# EAGLE design opac_c1 (EAGLE 6.3)

## Sheet 1 of 2
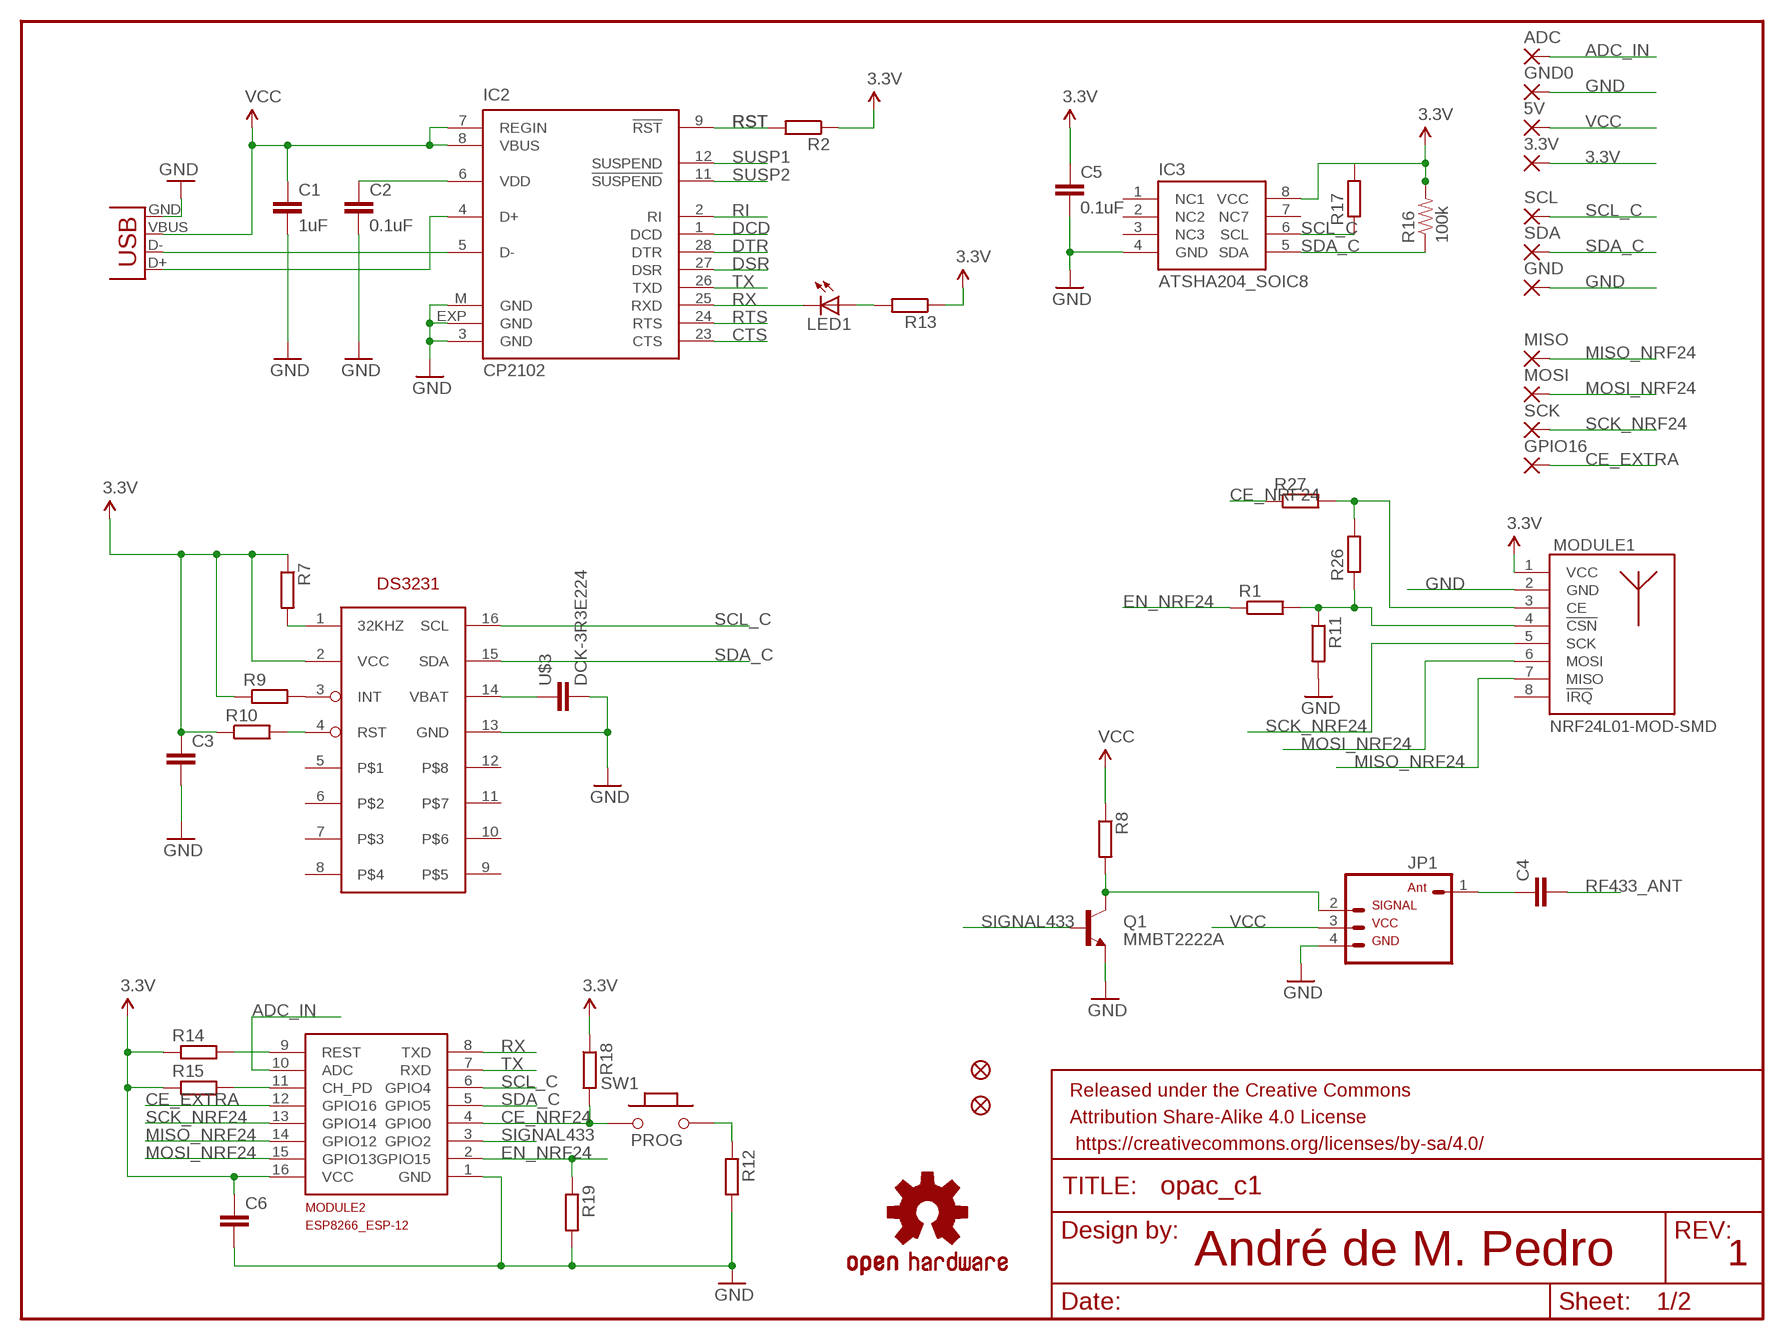
[diagram p0: schematic, sheet 1]

### Parts
3.3V  SMD2  [SMD1,27-2,54]
5V  SMD2  [SMD1,27-2,54]
ADC  SMD2  [SMD1,27-2,54]
C1  1uF  CAP0603  [0603]
C2  0.1uF  CAP0603  [0603]
C3  C-EUC0805K  [C0805K]
C4  C-EUC0603K  [C0603K]
C5  0.1uF  CAP0805  [0805]
C6  C-EUC0805K  [C0805K]
FRAME1  FRAME-LETTER  [CREATIVE_COMMONS]
GND  SMD2  [SMD1,27-2,54]
GND0  SMD2  [SMD1,27-2,54]
GPIO16  SMD2  [SMD1,27-2,54]
IC1  DS3231WIDE  [SO16W]
IC2  CP2102  CP210X_USB_UART  [MLP28]
IC3  ATSHA204_SOIC8  [SOIC8]
JP1  RF433SMD  [1X04-SMD]
JP2  FIDUCIAL1X2.5  [FIDUCIAL-1X2.5]
JP3  FIDUCIAL1X2.5  [FIDUCIAL-1X2.5]
LED1  LEDCHIP-LED0805  [CHIP-LED0805]
LOGO1  OSHW-LOGOL  [OSHW-LOGO-L]
MISO  SMD2  [SMD1,27-2,54]
MODULE1  NRF24L01-MOD-SMD  [SMD8-MODULE]
MODULE2  ESP8266_ESP-12  [ESP8266-ESP12]
MOSI  SMD2  [SMD1,27-2,54]
Q1  MMBT2222A  TRANSISTOR_NPNMMBT2222A  [SOT23-3]
R1  R-EU_R0805  [0805]
R2  R-EU_R0603  [R0603]
R7  R-EU_R0805  [0805]
R8  R-EU_R0805  [0805]
R9  R-EU_R0805  [0805]
R10  R-EU_R0805  [0805]
R11  R-EU_R0805  [0805]
R12  R-EU_R0805  [0805]
R13  R-EU_R0603  [R0603]
R14  R-EU_R0805  [0805]
R15  R-EU_R0805  [0805]
R16  100k  RESISTOR0805-RES  [0805]
R17  R-EU_R0805  [0805]
R18  R-EU_R0805  [0805]
R19  R-EU_R0805  [0805]
R26  R-EU_R0805  [0805]
R27  R-EU_R0805  [0805]
SCK  SMD2  [SMD1,27-2,54]
SCL  SMD2  [SMD1,27-2,54]
SDA  SMD2  [SMD1,27-2,54]
SW1  PROG  PB157  [157SW]
U$3  DCK-3R3E224  [DCK-3R3E224]
USB1  USB-MICROB  [USB-MICROB]

### Nets
3.3V: 3.3V.1(P) C3.1 C5.1 C6.1 IC1.2(VCC) IC3.8(VCC) MODULE1.1(VCC) MODULE2.16(VCC) R2.1 R7.1 R9.1 R10.1 R13.1 R14.1 R15.1 R16.2 R17.2 R18.1 ; also sheet 2
ADC_IN: ADC.1(P) MODULE2.10(ADC)
CE_EXTRA: GPIO16.1(P) MODULE2.12(GPIO16)
CE_NRF24: MODULE2.4(GPIO0) R18.2 R27.1 SW1.1
CTS: IC2.23(CTS)
DCD: IC2.1(DCD)
DSR: IC2.27(DSR)
DTR: IC2.28(DTR)
EN_NRF24: MODULE2.2(GPIO15) R1.1 R19.1
GND: C1.2 C2.2 C3.2 C5.2 C6.2 GND0.1(P) GND.1(P) IC1.13(GND) IC2.3(GND) IC2.EXP(GND) IC2.M(GND) IC3.4(GND) JP1.4 MODULE1.2(GND) MODULE2.1(GND) Q1.2(E) R11.2 R12.2 R19.2 U$3.P$1 USB1.GND ; also sheet 2
MISO_NRF24: MISO.1(P) MODULE1.7(MISO) MODULE2.14(GPIO12)
MOSI_NRF24: MODULE1.6(MOSI) MODULE2.15(GPIO13) MOSI.1(P)
N$1: IC1.14(VBAT) U$3.P$2
N$2: IC1.3(INT) R9.2
N$3: MODULE1.4(!CSN) R1.2 R11.1 R26.1
N$4: C2.1 IC2.6(VDD)
N$10: IC1.1(32KHZ) R7.2
N$11: R12.1 SW1.2
N$13: IC2.5(D-) USB1.D-
N$16: IC2.4(D+) USB1.D+
N$19: JP1.2 Q1.3(C) R8.2
N$23: MODULE1.3(CE) R26.2 R27.2
N$24: IC1.4(RST) R10.2
N$25: LED1.A R13.2
N$26: C4.1 JP1.1
N$27: MODULE2.9(REST) R14.2
N$28: MODULE2.11(CH_PD) R15.2
RF433_ANT: C4.2
RI: IC2.2(RI)
RST: IC2.9(!RST) R2.2
RTS: IC2.24(RTS)
RX: IC2.25(RXD) LED1.C MODULE2.8(TXD)
SCK_NRF24: MODULE1.5(SCK) MODULE2.13(GPIO14) SCK.1(P)
SCL_C: IC1.16(SCL) IC3.6(SCL) MODULE2.6(GPIO4) R17.1 SCL.1(P)
SDA_C: IC1.15(SDA) IC3.5(SDA) MODULE2.5(GPIO5) R16.1 SDA.1(P)
SIGNAL433: MODULE2.3(GPIO2) Q1.1(B)
SUSP1: IC2.12(SUSPEND)
SUSP2: IC2.11(!SUSPEND)
TX: IC2.26(TXD) MODULE2.7(RXD)
VCC: 5V.1(P) C1.1 IC2.7(REGIN) IC2.8(VBUS) JP1.3 R8.1 USB1.VBUS ; also sheet 2
Unconnected: IC1.5 IC1.6 IC1.7 IC1.8 IC1.9 IC1.10 IC1.11 IC1.12 IC3.1(NC1) IC3.2(NC2) IC3.3(NC3) IC3.7(NC7) MODULE1.8(!IRQ)

### Notes on the sheet
- André de M. Pedro | 1

## Sheet 2 of 2
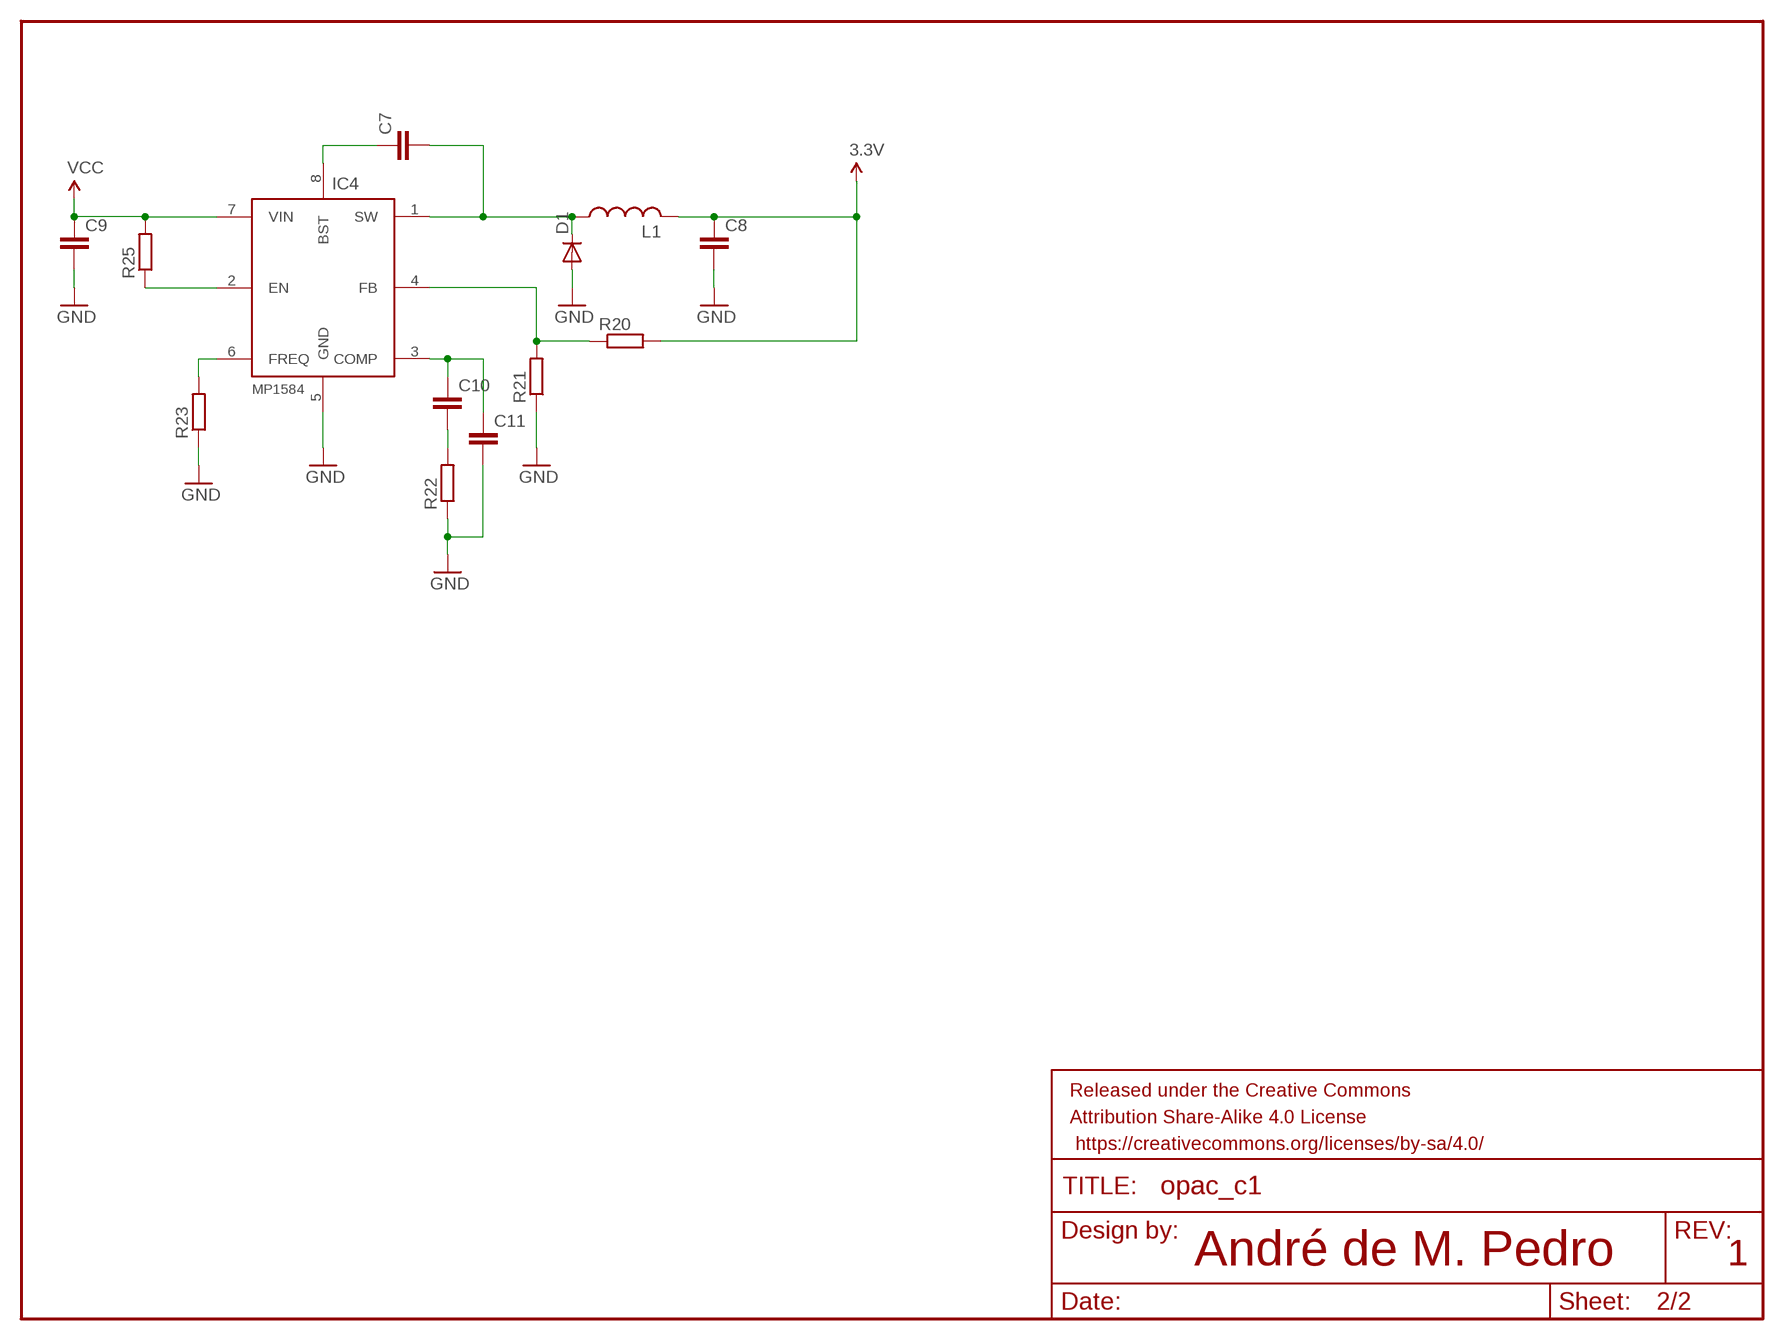
[diagram p1: schematic, sheet 2]

### Parts
C7  C-EUC0603  [C0603]
C8  C-EUC3216  [C3216]
C9  C-EUC3216  [C3216]
C10  C-EUC0603  [C0603]
C11  C-EUC0603  [C0603]
D1  DIODESMA  [SMA-DIODE]
FRAME2  FRAME-LETTER  [CREATIVE_COMMONS]
IC4  MP1584  [SO08-EPAD]
L1  IHLP-2525CZ-01  [2525]
R20  R-EU_R0603  [R0603]
R21  R-EU_R0603  [R0603]
R22  R-EU_R0603  [R0603]
R23  R-EU_R0603  [R0603]
R25  R-EU_R0603  [R0603]

### Nets
3.3V: C8.1 L1.P$1 R20.2 ; also sheet 1
GND: C8.2 C9.2 C11.2 D1.A IC4.5(GND) R21.1 R22.1 R23.1 ; also sheet 1
N$17: C7.2 D1.C IC4.1(SW) L1.P$2
N$18: C7.1 IC4.8(BST)
N$31: IC4.4(FB) R20.1 R21.2
N$32: IC4.2(EN) R25.1
N$33: IC4.6(FREQ) R23.2
N$34: C10.1 C11.1 IC4.3(COMP)
N$35: C10.2 R22.2
VCC: C9.1 IC4.7(VIN) R25.2 ; also sheet 1

### Notes on the sheet
- André de M. Pedro | 1

## Library data of the parts
3.3V 5V ADC GND GND0 GPIO16 MISO MOSI SCK SCL SDA = wirepad:SMD2: SMD PAD
C1 C2 = SparkFun:CAP: Capacitor Standard 0603 ceramic capacitor, and 0.1" leaded capacitor.
C3 C4 C6-C11 = resistor:C-EU: CAPACITOR, European symbol
C5 = SparkFun-Passives:CAP: Capacitor Standard 0603 ceramic capacitor, and 0.1" leaded capacitor.
D1 = SparkFun:DIODE: Diode These are standard reverse protection diodes and small signal diodes. SMA package can handle up to about 1A. SOD-323 can handle about 200mA. What the SOD-323 package when ordering, there are some mfgs out there that are 5-pin packages.
FRAME1 FRAME2 = SparkFun-Aesthetics:FRAME-LETTER: Schematic Frame Standard 8.5x11 US Letter frame
IC1 = DS3231:DS3231
IC2 = SparkFun:CP210X_USB_UART: Single-Chip USB to UART Bridge Source: www.silabs.com .. CP2101.pdf / cp2102.pdf. Spark Fun Electronics SKU : COM-00310
IC3 = SparkFun-DigitalIC:ATSHA204_SOIC8: ATSHA204; PROD_ID: IC-11981
IC4 = apedro_lib:MP1584
JP1 = apedro_lib:RF433: Header 4 Standard 4-pin 0.1" header. Use with straight break away headers (SKU : PRT-00116), right angle break away headers (PRT-00553), swiss pins (PRT-00743), machine pins (PRT-00117), and female headers (PRT-00115). Molex polarized connector foot print use with SKU : PRT-08231 with associated crimp pins and housings.
JP2 JP3 = SparkFun:FIDUCIAL: Fiducial Alignment Points Various fiducial points for machine vision alignment.
L1 = RNH_IHLP-2525CZ-01:IHLP-2525CZ-01
LED1 = led:LED: LED OSRAM: - CHIPLED LG R971, LG N971, LY N971, LG Q971, LY Q971, LO R971, LY R971 LH N974, LH R974 LS Q976, LO Q976, LY Q976 LO Q996 - Hyper CHIPLED LW Q18S LB Q993, LB Q99A, LB R99A - SideLED LS A670, LO A670, LY A670, LG A670, LP A670 LB A673, LV A673, LT A673, LW A673 LH A674 LY A675 LS A676, LA A676, LO A676, LY A676, LW A676 LS A679, LY A679, LG A679 - Hyper Micro SIDELED® LS Y876, LA Y876, LO Y876, LY Y876 LT Y87S - SmartLED LW L88C, LW L88S LB L89C, LB L89S, LG L890 LS L89K, LO L89K, LY L89K LS L896, LA L896, LO L896, LY L896 - TOPLED LS T670, LO T670, LY T670, LG T670, LP T670 LSG T670, LSP T670, LSY T670, LOP T670, LYG T670 LG T671, LOG T671, LSG T671 LB T673, LV T673, LT T673, LW T673 LH T674 LS T676, LA T676, LO T676, LY T676, LB T676, LH T676, LSB T676, LW T676 LB T67C, LV T67C, LT T67C, LS T67K, LO T67K, LY T67K, LW E67C LS E67B, LA E67B, LO E67B, LY E67B, LB E67C, LV E67C, LT E67C LW T67C LS T679, LY T679, LG T679 LS T770, LO T770, LY T770, LG T770, LP T770 LB T773, LV T773, LT T773, LW T773 LH T774 LS E675, LA E675, LY E675, LS T675 LS T776, LA T776, LO T776, LY T776, LB T776 LHGB T686 LT T68C, LB T68C - Hyper Mini TOPLED® LB M676 - Mini TOPLED Santana® LG M470 LS M47K, LO M47K, LY M47K Source: http://www.osram.convergy.de LUXEON: - LUMILED® LXK2-PW12-R00, LXK2-PW12-S00, LXK2-PW14-U00, LXK2-PW14-V00 LXK2-PM12-R00, LXK2-PM12-S00, LXK2-PM14-U00 LXK2-PE12-Q00, LXK2-PE12-R00, LXK2-PE12-S00, LXK2-PE14-T00, LXK2-PE14-U00 LXK2-PB12-K00, LXK2-PB12-L00, LXK2-PB12-M00, LXK2-PB14-N00, LXK2-PB14-P00, LXK2-PB14-Q00 LXK2-PR12-L00, LXK2-PR12-M00, LXK2-PR14-Q00, LXK2-PR14-R00 LXK2-PD12-Q00, LXK2-PD12-R00, LXK2-PD12-S00 LXK2-PH12-R00, LXK2-PH12-S00 LXK2-PL12-P00, LXK2-PL12-Q00, LXK2-PL12-R00 Source: www.luxeon.com KINGBRIGHT: KA-3528ASYC Source: www.kingbright.com
LOGO1 = SparkFun-Aesthetics:OSHW-LOGO: Open Source Hardware Logo This logo indicates the piece of hardware it is found on incorporates a OSHW license and/or adheres to the definition of open source hardware found here: http://freedomdefined.org/OSHW
MODULE1 = nrf24l01:NRF24L01-MOD: NRF24L01 based module VCC = 1.9~3.6V
MODULE2 = ESP8266-ESP12:ESP8266_ESP-12
Q1 = SparkFun-DiscreteSemi:TRANSISTOR_NPN: Generic NPN BJT MMBT2222A - TRANS-08049 (SOT-23, 1A 40V) MPSA42 - TRANS-09116 (SOT-23, 500mA 300V) MMBT5088LT1G - TRANS-11160 (SOT-23, 50 mA 30V) BC547 - COM-08928 <http://www.sparkfun.com/products/8928> (TO-92 45V 100mA) (1.Collector 2.Base 3.Emitter) 2N3904 - COM-00521 <http://www.sparkfun.com/products/521> (TO-92 40V 200mA) (1.Emitter 2.Base 3.Collector) P2N2222A - COM-12852 <http://www.sparkfun.com/products/12852> (TO-92 40V 600mA) (1.Collector 2.Base 3.Emitter); PROD_ID: TRANS-08049
R1 R2 R7-R15 R17-R23 R25-R27 = resistor:R-EU_: RESISTOR, European symbol
R16 = SparkFun-Passives:RESISTOR: Resistor Basic schematic elements and footprints for 0603, 1206, and PTH resistors.
SW1 = MySMD:PB157; PARTNO: RS 682-1421
U$3 = apedro_lib:DCK-3R3E224
USB1 = SparkFun:USB: USB Connectors USB-B-PTH is fully proven SKU : PRT-00139 USB-miniB is fully proven SKU : PRT-00587 USB-A-PCB is untested. USB-A-H is throughly reviewed, but untested. Spark Fun Electronics SKU : PRT-00437 USB-B-SMT is throughly reviewed, but untested. Needs silkscreen touching up. USB-A-S has not been used/tested USB-MB-H has not been used/tested

## Board
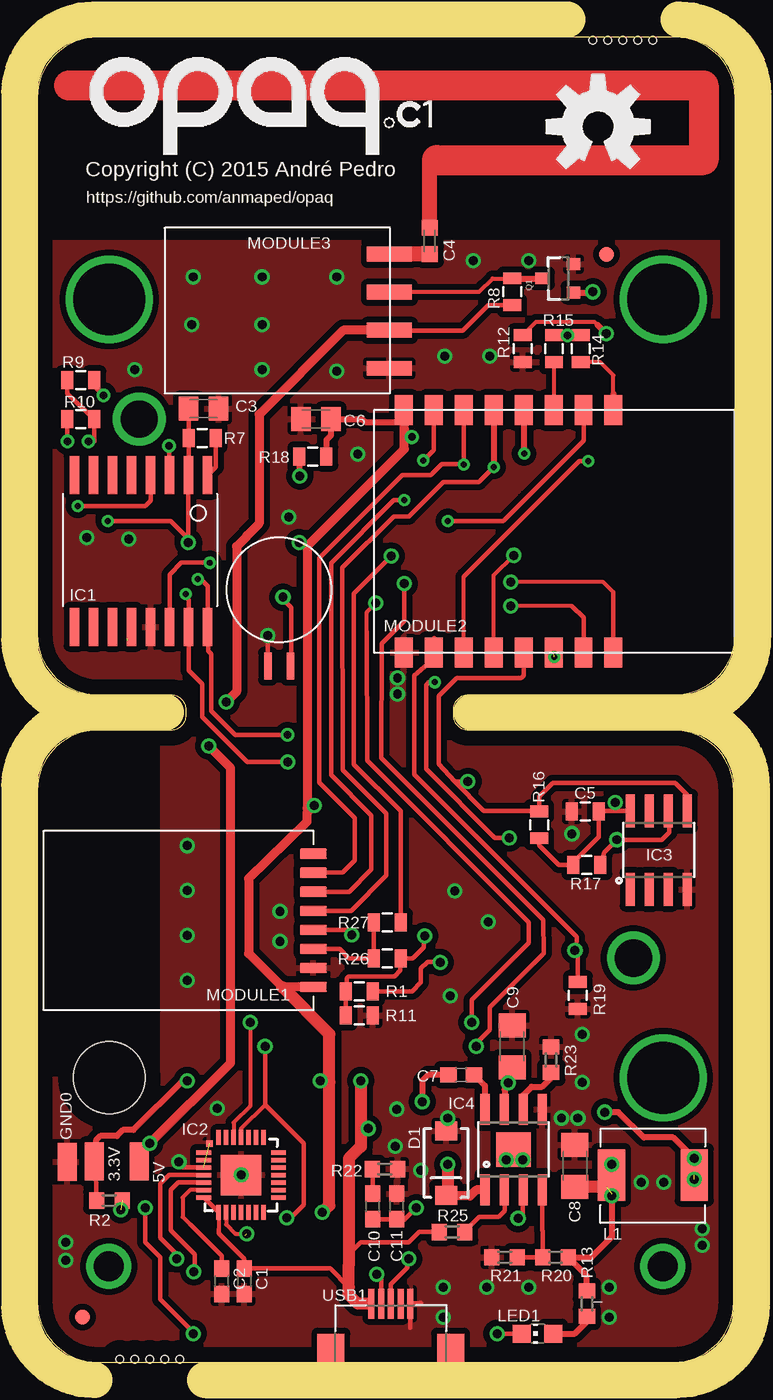
[diagram p2: board, top side]
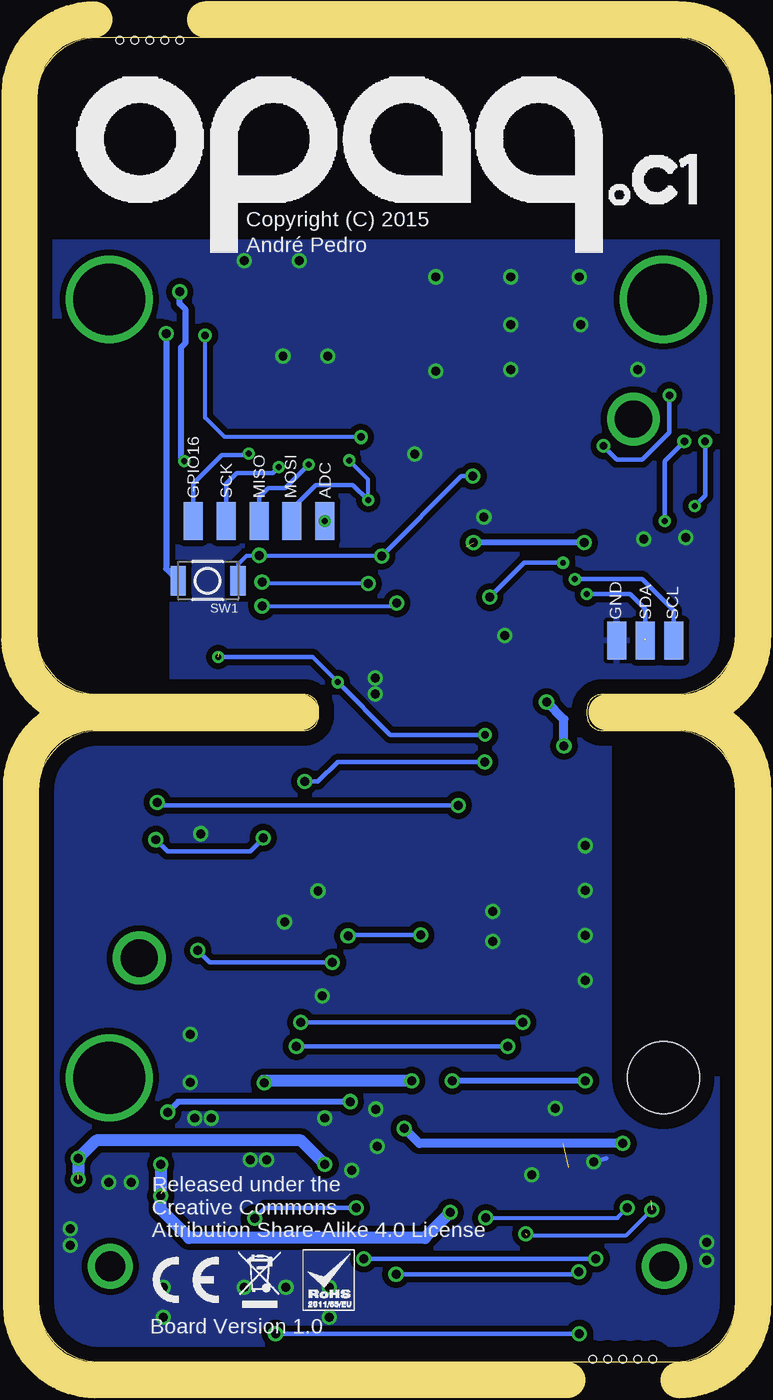
[diagram p3: board, bottom side, seen from below]

Size 46.6 x 88.5 mm. Coordinates in mm from the lower left corner, seen from the top.
Outline: 46.5,4 46.5,38.2 arc90 42.5,42.2 28.8,42.2 arc-90 27.8,43.2 27.8,43.6 arc-90 28.8,44.6 42.6,44.6 arc90 46.6,48.6 46.6,84.5 arc90 42.6,88.5 4,88.5 arc90 0,84.5 0,48.6 arc90 4,44.6 8.9,44.6 arc-90 9.9,43.6 9.9,43.2 arc-90 8.9,42.2 4,42.2 arc90 0,38.2 0,4 arc90 4,0 42.5,0 arc90 46.5,4
Copper layers (1*16): Top 0.035mm / dielectric 1.5mm / Bottom 0.035mm
Design rules "default *": minimum track width 10mil, minimum drill 5mil, track to track 7mil, track to pad 7mil, pad to pad 7mil, via to via 7mil, smd to smd 7mil, copper to edge 40mil, drill to drill 8mil, minimum pad ring 10mil, minimum via ring 8mil, stop-mask expansion 4mil, vias tented up to drill 0mil, thermal gap 10mil
Holes 4.8 mm at 4.8,19
Holes 0.5 mm at 5.5,0.2 6.5,0.2 7.5,0.2 8.5,0.2 9.5,0.2 37.1,88.3 38.1,88.3 39.1,88.3 40.1,88.3 41.1,88.3
tRestrict: area 0.1,75.4 to 46.5,88.5; area 0,19.5 to 7.8,41.5; area 38.2,43.5 to 46.5,69.3
bRestrict: area 38.2,43.5 to 46.5,69.3; area 0.1,75.4 to 46.5,88.5; area 0,19.5 to 7.8,41.5
Milling: 16 lines

### Footprints (pad centres in the part's own frame; a part is rotated, then mirrored left to right if it is on the bottom)
SMD1,27-2,54 = smd 1.27 x 2.54: 1 0,0
0603 = smd 1.1 x 1: 1 -0.85,0; 2 0.85,0
C0805K = smd 1.3 x 1.6: 1 -1,0; 2 1,0
C0603K = smd 1.05 x 1.08: 1 -0.875,0; 2 0.875,0
0805 = smd 0.8 x 1.2: 1 -0.9,0; 2 0.9,0
C0603 = smd 1.1 x 1: 1 -0.85,0; 2 0.85,0
C3216 = smd 1.6 x 1.8: 1 -1.4,0; 2 1.4,0
SMA-DIODE = smd 1.27 x 1.47: A -2.15,0; C 2.15,0
SO16W = smd 0.635 x 2.54: 1 0.635,-1.27; 2 1.905,-1.27; 3 3.175,-1.27; 4 4.445,-1.27; 5 5.715,-1.27; 6 6.985,-1.27; 7 8.255,-1.27; 8 9.525,-1.27; 9 9.525,8.89; 10 8.255,8.89; 11 6.985,8.89; 12 5.715,8.89; 13 4.445,8.89; 14 3.175,8.89; 15 1.905,8.89; 16 0.635,8.89
MLP28 = smd 1 x 0.3: 1 -2.5,1.5; 2 -2.5,1; 3 -2.5,0.5; 4 -2.5,0; 5 -2.5,-0.5; 6 -2.5,-1; 7 -2.5,-1.5; 15 2.5,-1.5; 16 2.5,-1; 17 2.5,-0.5; 18 2.5,0; 19 2.5,0.5; 20 2.5,1; 21 2.5,1.5 | smd 0.3 x 1: 8 -1.5,-2.5; 9 -1,-2.5; 10 -0.5,-2.5; 11 0,-2.5; 12 0.5,-2.5; 13 1,-2.5; 14 1.5,-2.5; 22 1.5,2.5; 23 1,2.5; 24 0.5,2.5; 25 0,2.5; 26 -0.5,2.5; 27 -1,2.5; 28 -1.5,2.5 | smd 2.7 x 2.7: EXP 0,0 | smd 0.435 x 0.435: M -2.103,2.103
SOIC8 = smd 0.61 x 2.21: 1 -1.905,-2.616; 2 -0.635,-2.616; 3 0.635,-2.616; 4 1.905,-2.616; 5 1.905,2.616; 6 0.635,2.616; 7 -0.635,2.616; 8 -1.905,2.616
SO08-EPAD = smd 0.61 x 2.057: 1 -1.905,-2.692; 2 -0.635,-2.692; 3 0.635,-2.692; 4 1.905,-2.692; 5 1.905,2.692; 6 0.635,2.692; 7 -0.635,2.692; 8 -1.905,2.692 | smd 2.286 x 2.286: EPAD 0,0
1X04-SMD = smd 1 x 3: 1 -3.81,5; 2 -1.27,5; 3 1.27,5; 4 3.81,5
FIDUCIAL-1X2.5 = smd 1 x 1: 1 0,0
2525 = smd 1.829 x 3.429: P$1 2.769,0; P$2 -2.769,0
CHIP-LED0805 = smd 1.2 x 1.2: A 0,-1.05; C 0,1.05
SMD8-MODULE = smd 0.7 x 1.8: 1 -4.445,0; 2 -3.175,0; 3 -1.905,0; 4 -0.635,0; 5 0.635,0; 6 1.905,0; 7 3.175,0; 8 4.445,0
ESP8266-ESP12 = smd 2 x 1.2: 1 16.2,2; 2 16.2,4; 3 16.2,6; 4 16.2,8; 5 16.2,10; 6 16.2,12; 7 16.2,14; 8 16.2,16; 9 0,16; 10 0,14; 11 0,12; 12 0,10; 13 0,8; 14 0,6; 15 0,4; 16 0,2
SOT23-3 = smd 0.8 x 0.9: 1 -0.95,-1; 2 0.95,-1; 3 0,1.1
R0603 = smd 1 x 1.1: 1 -0.85,0; 2 0.85,0
157SW = smd 1.016 x 1.981: 1 0,0; 2 4,0
DCK-3R3E224 = smd 0.5 x 1.8: P$1 -0.75,-5.1; P$2 0.75,-5.11
USB-MICROB = smd 0.4 x 2: D+ 0,3.1; D- -0.65,3.1; GND 1.3,3.1; ID 0.65,3.1; VBUS -1.3,3.1 | smd 1.8 x 1.9: GND@2 -4,0.15; GND@3 4,0.15

### Placement (x,y rotation side)
3.3V  3.8,13.4 0 top
5V  6.8,13.4 0 top
ADC  27.4,56.2 0 bottom
C1  13.8,5.4 270 top
C2  12.3,5.4 270 top
C3  11.1,63.7 0 top
C4  26.2,74.9 90 top
C5  36.6,36.8 180 top
C6  18.6,63 180 top
C7  28.3,19.2 180 top
C8  35.9,13.1 90 top
C9  31.7,21.1 90 top
C10  22.4,10.4 90 top
C11  24,10.4 90 top
D1  27.3,13.3 270 top
FRAME1  -12.7,-17.7 0 top  (outside the outline)
FRAME2  -12.7,-17.7 0 top  (outside the outline)
GND  7.9,48.2 0 bottom
GND0  1.98,13.37 0 top
GPIO16  36.2,56.2 0 bottom
IC1  12,58 180 top
IC2  13.6,12.5 0 top
IC3  41.5,34.2 0 top
IC4  31.8,14.2 0 top
JP1  18.5,70.2 270 top
JP2  3,3 0 top
JP3  38,74 0 top
L1  41.1,12.5 180 top
LED1  33.4,1.9 90 top
LOGO1  37.44,82.53 0 top
MISO  31.8,56.2 0 bottom
MODULE1  18.43,29.51 90 top
MODULE2  22.47,63.6 270 top
MOSI  29.6,56.2 0 bottom
Q1  34.8,72.4 90 top
R1  21.51,24.77 180 top
R2  4.8,10.8 0 top
R7  11,61.72 0 top
R8  31.7,71.5 90 top
R9  2.9,65.6 0 top
R10  2.9,63 180 top
R11  21.48,23.15 0 top
R12  32.4,67.7 270 top
R13  36.7,3.9 270 top
R14  36.3,67.7 270 top
R15  34.5,67.7 270 top
R16  33.5,35.9 270 top
R17  36.7,33.2 180 top
R18  18.4,60.5 180 top
R19  36.1,24.5 270 top
R20  34.6,7 0 top
R21  31.2,7 0 top
R22  23.2,12.9 180 top
R23  34.3,20.2 270 top
R25  27.7,8.7 180 top
R26  23.37,26.98 180 top
R27  23.37,29.36 180 top
SCK  34,56.2 0 bottom
SCL  4.1,48.2 0 bottom
SDA  6,48.2 0 bottom
SW1  33.2,52.2 180 bottom
U$3  16.14,51.6 0 top
USB1  23.6,0.8 0 top

### Tracks (layer width: path | path; a pad name or v marks a point on that pad's centre or on a via)
3.3V  (via drill 0.4, 0.5, 0.6)  (2 unrouted)
  Top 0.254: MODULE2.16 24.5,63.57 24.5,62.3 v25,61.8
  Top 0.305: R16.2 33.5,34.5 34.8,33.2 R17.2 36.15,33.75 37.5,35.1 C5.1 37.52,36.82 38.7,36.82 | IC3.8 38.7,36.82 | 18,36.7 18.15,36.85 v18.5,37.2 | v38.6,37.4 38.6,36.92 38.7,36.82 | R2.1 3.85,13.35 3.3V.1 | v3.4,61.5 3.8,61.5 R10.1 2,64.7 R9.1 | v4.7,56.2 8.9,56.2 10.09,55.02 v10.09,54.74 10.09,59.26 IC1.2 | IC1.2 | IC1.2 R7.1 C3.1
  Top 0.406: R14.1 v35.4,68.6 R15.1 | 24.5,62.65 MODULE2.16 24.35,62.8 21.9,62.8 21.7,63 C6.1 19.6,61.9 19.3,61.6 R18.1 | 3.9,12.7 3.3V.1 3.9,13.5 3.9,14.8 4.2,15.1 5.3,15.1 5.7,15.5 6.4,15.5 9.7,18.8 v10,18.8 | v18.9,18.8 19.4,18.8 19.5,18.7 | v38.36,11.1 38.36,8.36 37,7 R20.2 36.7,5.75 R13.1
  Top 0.61: 18,36.7 18,36.1 14.1,32.3 14.1,27.3 16.34,25.07 MODULE1.1 | 24.5,62.65 24.5,62.3 24.5,61 17.97,54.47 18.01,54.43 18.01,36.99 18.15,36.85
  Top 0.813: 16.34,25.07 19.5,21.9 19.5,18.7 19.5,10.46 v19.03,9.99 | 35.9,11.4 C8.1 38.03,11.7 L1.P$1
  Bottom 0.254: v25,61.8 34.1,61.8 35.4,63.1 v35.4,68.6
  Bottom 0.305: v18.5,37.2 38.4,37.2 v38.6,37.4 | v3.4,61.5 4.7,60.2 v4.7,56.2
  Bottom 0.406: v10,18.8 v18.9,18.8 | v10.09,54.74 v17.48,54.74 | v38.36,11.1 38.36,11.24
  Bottom 0.813: v19.03,9.99 20.72,8.3 36.46,8.3 38.36,10.2 v38.36,11.1 v38.36,13.2
ADC_IN  (via drill 0.4)
  Top 0.305: MODULE2.10 36.47,61.57 32.7,57.8 32.5,57.6 31.1,56.2 ADC.1
  other vias: 27.4,56.2
CE_EXTRA  (via drill 0.4)
  Top 0.406: v32.5,60.7 32.5,62.65 MODULE2.12
  Bottom 0.305: GPIO16.1 36.2,58.7 34.3,60.6 32.6,60.6 v32.5,60.7
CE_NRF24  (via drill 0.6)
  Top 0.254: MODULE2.4 30.47,52.57 v31.8,53.9
  Top 0.305: v23.62,53.86 22.63,52.86 21.13,51.36 21.13,39.93 24.26,36.81 24.26,29.38 R27.1 24.29,29.39
  Top 0.406: R18.2 17.5,59.88 v17.51,59.19
  Bottom 0.254: 31.76,53.86 32.64,53.86 33.2,53.3 SW1.1 | v23.62,53.86 31.76,53.86 | 31.76,53.86 v31.8,53.9
  Bottom 0.305: v17.51,59.19 18.29,59.19 v23.62,53.86
EN_NRF24  (via drill 0.6)
  Top 0.305: 36,27.6 36.02,28.42 25.17,39.27 25.17,45.87 26.5,47 26.5,48.37 MODULE2.2 | R19.1 36.1,27.3 | R1.1 25.02,24.77 25.6,25.35 25.6,26.29 26.06,26.75 26.85,26.75 v26.9,26.7
  Top 0.406: 36,27.6 v35.9,27.5 36.1,27.3
  Bottom 0.305: v26.9,26.7 35.1,26.7 v35.9,27.5
GND  (via drill 0.6)  (1 unrouted)
  Top 0.305: 24.9,3.8 24.9,2.3 | IC2.3 9.5,13 v9.45,13.37 | U$3.P$1 v15.39,48.54
  Top 0.406: USB1.GND 25.6,3.9
  Bottom 0.305: v9.45,13.37 8.6,13.6
  other vias: 27.2,67.2 30.2,67.2 3.3,55.1 6.1,55 24.05,45.7 6.5,66.3 16.2,28.1 16.2,30.1 35.7,35.3 20,66.2 36.4,21.9 10.4,72.5 29.1,73.6 20,72.5 15,72.5 10.3,69.3 15,69.3 15,66.3 32.8,73.6 24.05,44.63 27.1,3 27.1,5 30,5 32.8,5 38.2,3 38.2,5 24,16.9 27.4,16.3 23.9,14.4 13.6,12.5 40.34,12 35,16.3 36.4,18.7 36.1,16.3 41.83,12 25.6,12.8 31.3,13.5 32.4,13.5 10,34.5 10,31.5 10,28.5 10,25.5 16.78,56.44 21.4,60.66 12.01,16.95 1.9,6.8 1.9,8 27.86,31.47 30.1,29.41 27.58,24.46 44.4,7.8 44.4,8.9
  pour Top (isolate 0.406): 0,88.5 46.5,88.5 46.5,0 0,0
  pour Bottom (isolate 0.406): 0,88.5 46.5,88.5 46.5,0 0,0
MISO_NRF24  (via drill 0.4)
  Top 0.305: 18.45,32.7 20.4,32.7 21.2,33.5 21.2,36.36 18.82,38.74 18.82,53.72 24.37,59.27 26.27,59.27 27,60 28.44,60 v28.47,59.97 MODULE2.14
  Top 0.406: 18.45,32.7 MODULE1.7
  Bottom 0.305: MISO.1 31.8,57.8 31.2,58.4 30.04,58.4 v28.47,59.97
MOSI_NRF24  (via drill 0.4)
  Top 0.305: 24.05,57.58 v24.51,57.58 23.8,57.58 19.61,53.39 19.61,39.22 22.3,36.53 22.3,32.9 20.82,31.41 MODULE1.6 | MODULE2.15 26.47,60.93 v25.78,60.24
  Bottom 0.254: v24.51,57.58 24.51,58.97 v25.78,60.24
  Bottom 0.305: MOSI.1 29.6,57 28,58.6 25.53,58.6 v24.51,57.58
N$1  (via drill 0.4, 0.6)
  Top 0.305: v16.4,51.1 16.4,50.96 16.94,50.42 16.94,46.54 U$3.P$2 | IC1.14 8.82,52.62 9.6,53.4 v11.5,53.4
  Bottom 0.305: v16.4,51.1 14.1,53.4 v11.5,53.4
N$2  (via drill 0.5)
  Top 0.305: v8.8,61.2 8.8,59.3 IC1.3 | R9.2 3.8,65.2 v4.4,64.6
  Bottom 0.305: v8.8,61.2 7.9,60.3 6.2,60.3 4.4,62.1 v4.4,64.6
N$3  (via drill 0.6)
  Top 0.305: R11.1 20.58,24.9 R1.2 20.65,24.81 20.65,25.63 20.8,25.78 23.85,25.78 24.23,26.16 24.23,26.94 R26.1 25.08,26.98 25.8,27.7 25.8,28.42 v25.86,28.48 | MODULE1.4 20.66,28.88 v21.01,28.53
  Bottom 0.305: v21.01,28.53 25.86,28.53 v25.86,28.48
N$4
  Top 0.254: IC2.6 10.2,11.5 9.7,11 9.7,9.7 10.2,9.2
  Top 0.305: 12.2,6.35 C2.1 12.3,7.1 10.2,9.2
N$7  (via drill 2.5 pad 3)
  other vias: 6.8,63
N$8  (via drill 2 pad 3)
  other vias: 4.75,6.4
N$9  (via drill 2 pad 3)
  other vias: 41.75,6.4
N$10
  Top 0.305: R7.2 11.9,59.8 IC1.1
N$11  (via drill 0.6)
  Top 0.254: R12.1 33.3,69.5 37.2,69.5 37.4,69.3
  Top 0.406: 37.4,69.3 v38,68.7
  Bottom 0.406: v38,68.7 38,53 SW1.2 | SW1.2 | SW1.2
N$12  (via drill 4.8 pad 5.8)
  other vias: 41.8,19
N$13  (via drill 0.6)
  Top 0.305: USB1.D- 22.95,5.75 v22.65,5.87 | IC2.5 9.4,12 8.9,11.5 8.9,8.8 10.49,7.21 10.49,6.06 v10.45,6.02
  Bottom 0.305: v22.65,5.87 10.61,5.87 v10.45,6.02
N$14  (via drill 4.8 pad 5.8)
  other vias: 4.8,71
N$15  (via drill 4.8 pad 5.8)
  other vias: 41.8,71
N$16  (via drill 0.6)
  Top 0.305: USB1.D+ 23.6,5.2 24.7,6.3 24.7,6.8 v24.8,6.9 | IC2.4 8.8,12.5 8.2,11.9 8.2,8.3 9.3,7.2 v9.3,6.9
  Bottom 0.305: v24.8,6.9 v9.3,6.9
N$17  (via drill 0.6)  (1 unrouted)
  Top 0.406: 27.34,11.11 D1.C | 25.9,17.5 v25.7,17.4 25.7,18.8 26.1,19.2 C7.2 | v43.86,13.6 42.46,15 40.5,15 38.8,16.7 v37.9,16.7
  Top 0.61: IC4.1 29.31,11.51 28.9,11.1 27.35,11.1 D1.C
  Top 0.813: v27.4,13.2 27.4,11.25 D1.C
  Bottom 0.406: v25.7,17.4 37.2,17.4 v37.9,16.7
  Bottom 0.813: v27.4,13.2 29,14.8 42.66,14.8 v43.86,13.6 v43.86,12.2
N$18
  Top 0.406: IC4.8 29.89,18.45 C7.1
N$19
  Top 0.254: JP1.2 23.53,71.5 29.5,71.5 30.4,72.4 R8.2
  Top 0.406: R8.2 Q1.3
N$20  (via drill 2.5 pad 3)
  other vias: 39.8,27
N$21
  Top 1: 26.2,75.8 26.2,80.2
N$23
  Top 0.305: MODULE1.3 20.17,27.61 20.8,26.98 R26.2 R27.2
N$24  (via drill 0.4, 0.5)
  Top 0.305: IC1.4 7.55,57.55 7.2,57.2 v2.7,57.2 | v2,61.5 R10.2
  Bottom 0.305: v2,61.5 2,57.9 v2.7,57.2
N$25
  Top 0.406: LED1.A 35.9,1.9 36.7,2.7 R13.2
N$26
  Top 1: C4.1 JP1.1
N$27
  Top 0.254: 38.47,64.68 38.47,65.93 37.6,66.8 R14.2
  Top 0.406: 38.47,64.68 MODULE2.9
N$28
  Top 0.254: MODULE2.11 34.5,63.63 R15.2
N$29
  Top 2: 2.1,85.3 44.5,85.3 44.5,80.3 26.69,80.3
N$31
  Top 0.305: IC4.4 33.7,11.1 33.7,8.8 33.75,8.75 R20.1 R21.2
N$32
  Top 0.305: R25.1 28.55,8.75 29.5,9.7 30.8,9.7 31.2,10.1 31.2,11.47 IC4.2
N$33
  Top 0.406: IC4.6 32.44,17.84 33,18.4 33.7,18.4 34.3,19 R23.2
N$34  (via drill 0.6)
  Top 0.305: IC4.3 32.4,11.47 32.4,9.9 v32.1,9.6 | v25.3,10.3 24.5,9.5 24.05,9.5 C11.1 C10.1
  Bottom 0.305: v25.3,10.3 25.31,10.31 31.38,10.31 v32.1,9.6
N$35
  Top 0.305: R22.2 22.4,12.9 C10.2
RST  (via drill 0.6)  (2 unrouted)
  Top 0.254: IC2.9 12.6,9.2 13.22,8.58 v13.98,8.58
  Top 0.305: IC2.9
  Bottom 0.254: 13.88,8.48 7.27,8.48 v5.57,10.18
RX  (via drill 0.6)
  Top 0.254: 15.2,17.2 13.6,15.6 IC2.25 | 38.47,51.43 37.8,52.1 v31.6,52.1
  Top 0.305: 38.47,47.43 MODULE2.8 38.47,51.43 | v15.2,21.1 15.2,17.2 17.8,14.6 17.8,10.5 16.93,9.63 v16.65,9.63 | LED1.C v30.7,1.9 | v29.3,21.1 29.3,21.3 30.2,22.2 30.2,23.7 33.8,27.3 33.77,29.55 22.98,40.35 23,48 24.5,49.5 v24.5,52 | v7.2,10.3 7.2,8 8.2,7 8.2,4.2 10.4,2 v10.4,1.9
  Bottom 0.254: v16.65,9.63 7.87,9.63 v7.2,10.3 | v24.5,52 31.5,52 v31.6,52.1
  Bottom 0.305: 29.1,21.1 v15.2,21.1 | v30.7,1.9 v10.4,1.9
  Bottom 0.406: v29.3,21.1 29.1,21.1
SCK_NRF24  (via drill 0.4)
  Top 0.305: MODULE1.5 20.95,30.14 23.3,32.5 23.3,36.65 20.39,39.55 20.36,53.08 23.79,56.5 24.8,56.5 27.1,58.8 29.47,58.8 v30.47,59.8
  Top 0.406: MODULE2.13 v30.47,59.8
  Bottom 0.305: SCK.1 34,58.7 33.3,59.4 30.87,59.4 v30.47,59.8
SCL_C  (via drill 0.4, 0.5, 0.6)  (1 unrouted)
  Top 0.305: R17.1 37.85,34.05 v38.7,34.9 41.7,34.9 42.2,35.4 42.2,36.75 IC3.6 | v31.52,35.03 30.56,35.03 25.96,39.62 25.96,45.24 26.14,45.42 v26.54,45.42 | v16.7,41.9 13.2,41.9 11.6,43.5 11.6,47.3 11.4,47.5 11.4,49.08 IC1.16 11.37,51.84 10.9,52.3 v10.7,52.3
  Bottom 0.254: 28.22,47.1 v26.54,45.42
  Bottom 0.305: v31.52,35.03 31.52,34.98 32.4,34.1 37.9,34.1 v38.7,34.9 | v34.52,47.1 28.22,47.1 | SCL.1 4.1,50.2 6.2,52.3 v10.7,52.3 | v26.54,45.42 23.02,41.9 v16.7,41.9
SDA_C  (via drill 0.4, 0.6)  (1 unrouted)
  Top 0.305: R16.1 33.1,36.8 | R16.1 33.5,37.8 34.4,38.7 42.6,38.7 43.41,37.9 IC3.5 | 27.86,38.79 29.82,36.83 33.47,36.83 R16.1 | 27.86,38.79 26.8,39.95 26.8,44.5 28,45.7 28.2,45.7 32.3,45.7 32.47,45.87 MODULE2.5 32.47,47.83 32.5,47.8 | v28.75,38.79 27.86,38.79 | v16.72,40.1 14,40.1 11,43.1 11,45.3 10.1,46.2 IC1.15 10.1,50.91 9.7,51.3 v9.9,51.3
  Bottom 0.305: v16.72,40.1 26.55,40.1 27.88,38.77 28.74,38.77 v28.75,38.79 | SDA.1 6,50.3 7,51.3 v9.9,51.3
  Bottom 0.406: 5.7,48 6,48.3
SIGNAL433  (via drill 0.4, 0.6)
  Top 0.254: MODULE2.3 28.47,52.47 28.5,52.5
  Top 0.305: 28.5,52.5 36.2,60.2 v36.8,60.2
  Top 0.406: Q1.1 37.05,71.45 v37.1,71.5
  Bottom 0.406: v36.8,60.2 37,60.4 37,67.8 36.7,68.1 36.7,70.3 37.1,70.7 v37.1,71.5
TX  (via drill 0.6)
  Top 0.254: v14.2,22.7 14.2,17.1 13.1,16 IC2.26 | 35.7,50.5 v31.6,50.5 | 22,48.8 22,50.1 v22.6,50.7
  Top 0.305: 36.47,47.63 MODULE2.7 36.47,49.73 35.7,50.5 | 22,48.8 22.02,40.18 32.83,29.38 32.8,28 29,24.2 v29,22.7
  Bottom 0.254: v31.6,50.5 22.8,50.5 v22.6,50.7
  Bottom 0.305: v29,22.7 v14.2,22.7
VCC  (via drill 0.6)
  Top 0.254: IC2.8 12.1,8.9
  Top 0.305: 20.8,6.5 20.6,6.5 | R25.2 25.5,8.7 24.8,8 21.6,8 20.8,7.2 | 20.8,5 19.55,6.25 C1.1 13.8,6.9 12.1,8.6 12.1,8.9 | IC2.7 IC2.8 | JP1.3 23.53,68.9 28.4,68.9 30.1,70.6 R8.1
  Top 0.406: 5V.1 7.1,12.7 7.1,14.2 v7.5,14.6 | C9.1 31.7,18.9 v31.45,18.65 31.2,18.2 31.2,16.53 IC4.7 | v22.1,15.6 21.9,15.6 21.6,15.9 | 14,55.23 14,55.2 | USB1.VBUS 22,3.9
  Top 0.61: JP1.3 20.43,68.93 14.81,63.31 14.81,56.03 14,55.23 | v7.5,14.6 12.9,20 12.9,39.69 v11.43,41.16 | 14,55.2 13.3,54.5 13.3,44.8 v12.6,44.1
  Top 0.813: v21.6,18.8 21.6,15.9 21.6,14.4 20.8,13.6 20.8,7.2 20.8,6.5 20.8,5 20.8,4.5 21.4,3.9 22,3.9
  Bottom 0.61: v7.5,14.6 21.1,14.6 v22.1,15.6 | v11.43,41.16 11.43,42.93 v12.6,44.1
  Bottom 0.813: v21.6,18.8 31.5,18.8 v31.45,18.65

### Text on the board
tPlace: Copyright (C) 2015 André Pedro | https://github.com/anmaped/opaq | MODULE3
bPlace: Copyright (C) 2015 | André Pedro | Released under the / Creative Commons / Attribution Share-Alike 4.0 License | Board Version 1.0
tDocu: André Pedro